# Altium project AudioBox_Amp.PrjPcb
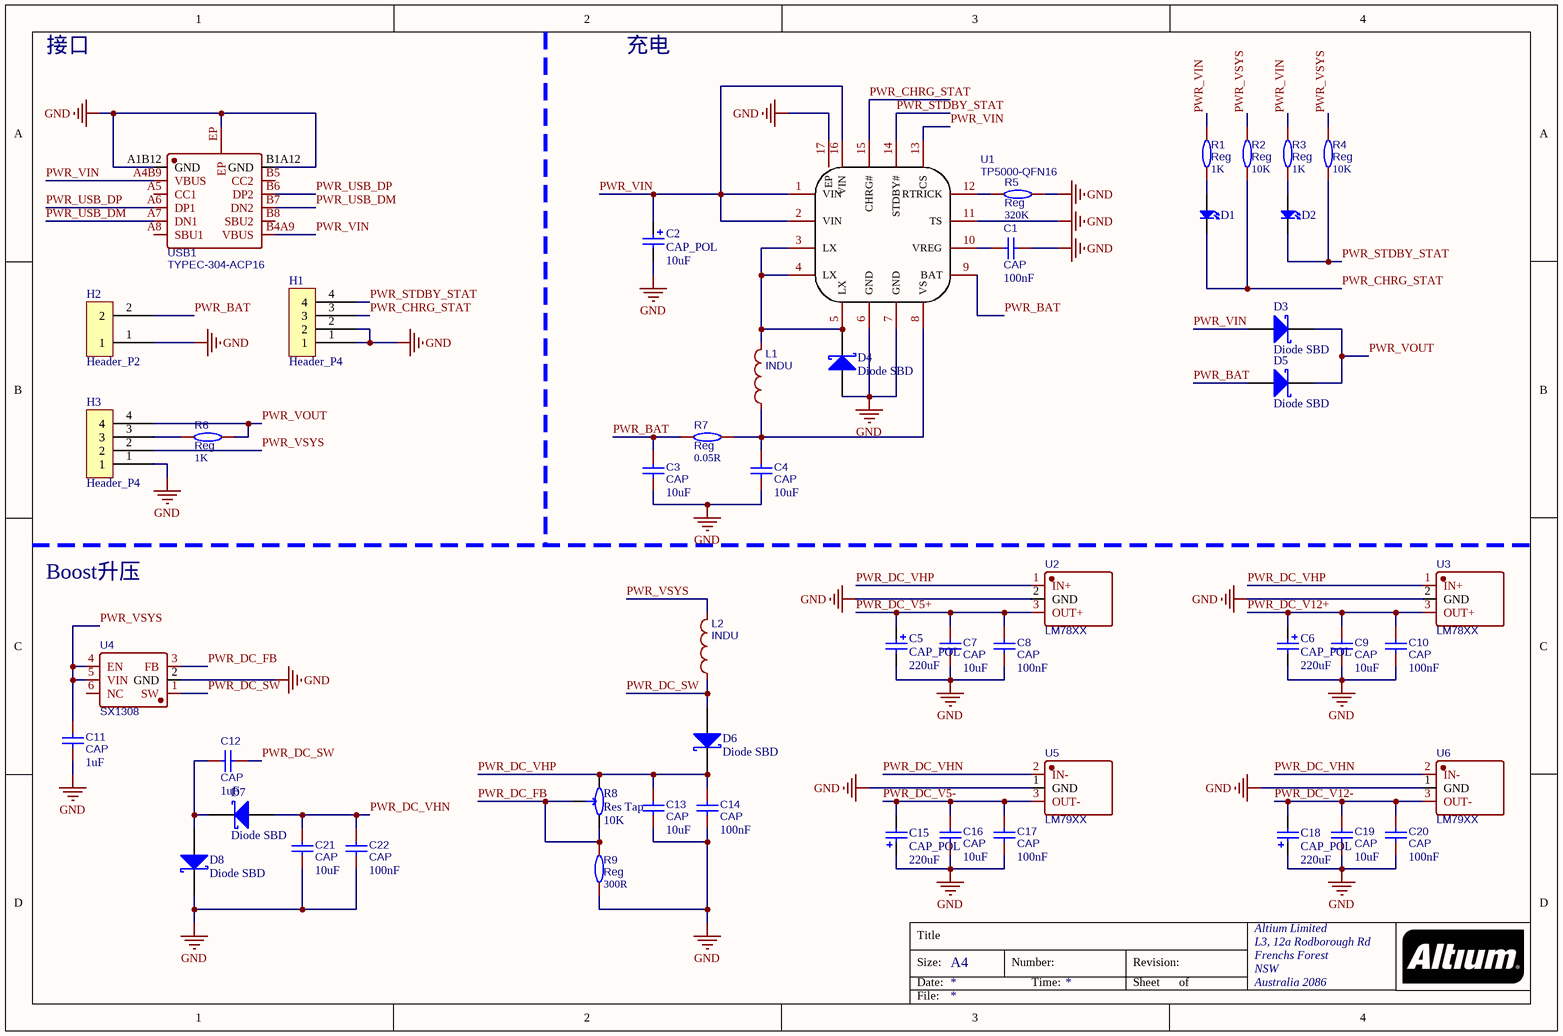
[diagram p0: Power.SchDoc]
4 sheets, 214 parts. Net scope: global (net labels, ports and power ports of the same name join across sheets).
Board files: AudioBoxAmpV3.PcbDoc, AudioBoxAmpV3-2.PcbDoc, AudioBoxAmpV3-3.PcbDoc
Sheets:
  Power.SchDoc
  Audio.SchDoc
  VU_LED.SchDoc
  FrantPannel.SchDoc

## Sheet Power.SchDoc
size A4; Organization: Altium Limited; Address1: L3, 12a Rodborough Rd; Address2: Frenchs Forest; Address3: NSW; Address4: Australia 2086

### Parts
C1  CAP  value 100nF  [C0603]
C2  CAP_POL  value 10uF  [CP1206]
C3  CAP  value 10uF  [C0603]
C4  CAP  value 10uF  [C0603]
C5  CAP_POL  value 220uF  [CAP_SMD_6.3mm]
C6  CAP_POL  value 220uF  [CAP_SMD_6.3mm]
C7  CAP  value 10uF  [C0603]
C8  CAP  value 100nF  [C0603]
C9  CAP  value 10uF  [C0603]
C10  CAP  value 100nF  [C0603]
C11  CAP  value 1uF  [C0603]
C12  CAP  value 1uF  [C0603]
C13  CAP  value 10uF  [C0603]
C14  CAP  value 100nF  [C0603]
C15  CAP_POL  value 220uF  [CAP_SMD_6.3mm]
C16  CAP  value 10uF  [C0603]
C17  CAP  value 100nF  [C0603]
C18  CAP_POL  value 220uF  [CAP_SMD_6.3mm]
C19  CAP  value 10uF  [C0603]
C20  CAP  value 100nF  [C0603]
C21  CAP  value 10uF  [C0603]
C22  CAP  value 100nF  [C0603]
D1  LED  [LED0603_Side]  (value not drawn)
D2  LED  [LED0603_Side]  (value not drawn)
D3  Diode SBD  [SMA_L4.3]
D4  Diode SBD  [SMA_L4.3]
D5  Diode SBD  [SMA_L4.3]
D6  Diode SBD  [SMA_L4.3]
D7  Diode SBD  [SMA_L4.3]
D8  Diode SBD  [SMA_L4.3]
H1  Header_P4  [PH_4Pin]
H2  Header_P2  [XH_2Pin]
H3  Header_P4  [PH_4Pin]
L1  INDU  [SMD_L7.1]
L2  INDU  [SMD_L7.1]
R1  Reg  value 1K  [R0603]
R2  Reg  value 10K  [R0603]
R3  Reg  value 1K  [R0603]
R4  Reg  value 10K  [R0603]
R5  Reg  value 320K  [R0603]
R6  Reg  value 1K  [R0603]
R7  Reg  value 0.05R  [R2512]
R8  Res Tap  value 10K  [RES_TAP_HOR]
R9  Reg  value 300R  [R0603]
U1  TP5000-QFN16  [QFN-16_L4.0-W4.0-P0.65-BL-EP2.2]
U2  LM78XX  [TO-220-3_2.54_HOR]
U3  LM78XX  [TO-220-3_2.54_HOR]
U4  SX1308  [SOT-23-6]
U5  LM79XX  [TO-220-3_2.54_HOR]
U6  LM79XX  [TO-220-3_2.54_HOR]
USB1  TYPEC-304-ACP16  [USB-C-SMD_TYPE-C-16P]

### Nets
GND: C1.2 C2.2 C3.2 C4.2 C5.2 C6.2 C7.2 C8.2 C9.2 C10.2 C11.2 C13.2 C14.2 C15.1 C16.2 C17.2 C18.1 C19.2 C20.2 C21.2 C22.2 D4.2(A) D8.1(K) H1.1 H1.2 H2.1 H3.1 R5.2 R9.1 U1.6(GND) U1.7(GND) U1.11(TS) U1.17(EP) U2.2(GND) U3.2(GND) U4.2(GND) U5.1(GND) U6.1(GND) USB1.A1B12(GND) USB1.B1A12(GND) USB1.EP
PWR_BAT: C3.1 D5.2(A) H2.2 R7.1 U1.9(BAT)
PWR_CHRG_STAT: D1.1(K) H1.3 R2.1 U1.15(CHRG#)
PWR_DC_FB: R8.1(A) R8.3(TAP) R9.2 U4.3(FB)
PWR_DC_SW: C12.1 D6.2(A) L2.1 U4.1(SW)
PWR_DC_V5+: C5.1 C7.1 C8.1 U2.3(OUT+)
PWR_DC_V5-: C15.2 C16.1 C17.1 U5.3(OUT-)
PWR_DC_V12+: C6.1 C9.1 C10.1 U3.3(OUT+)  [project net A_VLB12V+]
PWR_DC_V12-: C18.2 C19.1 C20.1 U6.3(OUT-)  [project net A_VLB12V-]
PWR_DC_VHN: C21.1 C22.1 D7.2(A) U5.2(IN-) U6.2(IN-)
PWR_DC_VHP: C13.1 C14.1 D6.1(K) R8.2(B) U2.1(IN+) U3.1(IN+)
PWR_STDBY_STAT: D2.1(K) H1.4 R4.1 U1.14(STDBY#)
PWR_USB_DM: USB1.A7(DN1) USB1.B7(DN2)
PWR_USB_DP: USB1.A6(DP1) USB1.B6(DP2)
PWR_VIN: C2.1 D3.2(A) R1.2 R3.2 U1.1(VIN) U1.2(VIN) U1.13(CS) U1.16(VIN) USB1.A4B9(VBUS) USB1.B4A9(VBUS)
PWR_VOUT: D3.1(K) D5.1(K) H3.4 R6.1
PWR_VSYS: C11.1 H3.2 L2.2 R2.2 R4.2 U4.4(EN) U4.5(VIN)
NetC1_1: C1.1 U1.10(VREG)
NetC4_1: C4.1 L1.1 R7.2 U1.8(VS)
NetC12_2: C12.2 D7.1(K) D8.2(A)
NetD1_2: D1.2(A) R1.1
NetD2_2: D2.2(A) R3.1
NetD4_1: D4.1(K) L1.2 U1.3(LX) U1.4(LX) U1.5(LX)
NetH3_3: H3.3 R6.2
NetR5_1: R5.1 U1.12(RTRICK)

Not connected (* = marked no-connect by the designer): U4 6(NC); USB1 A5(CC1) A8(SBU1) B5(CC2) B8(SBU2)

### Notes on the sheet
- 接口
- 充电
- Boost升压
- Title
- Size:
- Date:
- A4
- Number:
- Time:
- Revision:
- Sheet
- of
- File:

### Library data of the parts
C1 C3 C4 C7-C14 C16 C17 C19-C22 = CAP: BOM_Manufacturer: Huaxin S&T; BOM_Manufacturer Part: 0603B103K101CT; nameAlias: Capacitance; Contributor: LCSC; BOM_Supplier: LCSC; BOM_Supplier Part: C302008; spicePre: C; spiceSymbolName: 0603B103K101CT
C2 C5 C6 C15 C18 = CAP_POL: 极性电容
D1 D2 = LED0: Published: 8-Jun-2000; LatestRevisionDate: 08-Jul-2005; LatestRevisionNote: Mech Layer 1 removed.; PackageReference: LED-0; Publisher: Altium Limited; PackageDescription: LED; 2 Leads
D3-D8 = Diode SBD: Schottky Rectifier; Note: Terminal 2 is the TAB and is electrically connected to the cathode; Published: 8-Jun-2000; LatestRevisionDate: 17-Jul-2002; LatestRevisionNote: Re-released for DXP Platform.; DatasheetVersion: PD-2.057B; PackageVersion: Feb-1998; PackageReference: TO-220AC; Publisher: Altium Limited; PackageDescription: TO, Thru-Hole, Vertical, Heatsink Mounted; 3 In-Line Leads (1 Absent); Pitch 2.54 mm; ComponentLink1Description: Manufacturer Link; ComponentLink1URL: http://www.irf.com/; ComponentLink2Description: Datasheet; ComponentLink2URL: http://www.irf.com/product-info/datasheets/data/10tq.pdf
H1 H3 = Header_P4: 4Pin排针
H2 = Header_P2: 2Pin排针
L1 L2 = IND: 电感; BOM_Manufacturer: Sunltech Tech; BOM_Manufacturer Part: SLO0630H150MTT; nameAlias: Inductance; Contributor: LCSC; BOM_Supplier: LCSC; BOM_Supplier Part: C182182; BOM_JLCPCB Part Class: Extended Part; spicePre: L; spiceSymbolName: SLO0630H150MTT; Value: *
R1-R7 R9 = Res: 电阻; BOM_Manufacturer: Viking Tech; BOM_Manufacturer Part: AR03BTCX1002A; nameAlias: Resistance (Ohms); Contributor: LCSC; BOM_Supplier: LCSC; BOM_Supplier Part: C465721; spicePre: R; spiceSymbolName: AR03BTCX1002A
R8 = Res Tap: 可调电阻; Sim Note: Enter the Resistance value and the set point into parameter fields.; Set Position: 0.5; Published: 24-Mar-1999; LatestRevisionDate: 17-Jul-2002; LatestRevisionNote: Re-released for DXP Platform.; PackageReference: VR3; Publisher: Altium Limited; PackageDescription: Variable Resistor, Thru-Hole; 3 Leads
U1 = TP5000-QFN16: BOM_Manufacturer: TOPPOWER; BOM_Supplier: LCSC; BOM_Manufacturer Part: TP5000-QFN16; BOM_Supplier Part: C51699; BOM_JLCPCB Part Class: Extended Part; spicePre: U; spiceSymbolName: TP5000-QFN16
U2 U3 = LM78XX: 三端稳压(正电压); BOM_Manufacturer: HGSEMI(华冠); BOM_Manufacturer Part: LM7812T; Contributor: LCSC; BOM_Supplier: LCSC; BOM_Supplier Part: C2902509; BOM_JLCPCB Part Class: Extended Part; spicePre: U; spiceSymbolName: LM7812T
U4 = SX1308: 升压PWM; BOM_Manufacturer: SX; sourceId: g4Yg9rJ1j; timeStamp: 1472247539; BOM_Supplier: LCSC; BOM_Manufacturer Part: SX1308; BOM_Supplier Part: C78162; BOM_JLCPCB Part Class: Extended Part; spicePre: U; spiceSymbolName: SX1308
U5 U6 = LM79XX: 三端稳压(负电压); BOM_Manufacturer: HGSEMI(华冠); BOM_Manufacturer Part: LM7812T; Contributor: LCSC; BOM_Supplier: LCSC; BOM_Supplier Part: C2902509; BOM_JLCPCB Part Class: Extended Part; spicePre: U; spiceSymbolName: LM7812T
USB1 = USB_TYPEC_12P: 全引脚USB TYPEC母座; BOM_Manufacturer: XUNPU(讯普); Contributor: LCSC; BOM_Supplier: LCSC; BOM_Supplier Part: C2982555; BOM_Manufacturer Part: TYPEC-304-ACP16; BOM_JLCPCB Part Class: Extended Part; spicePre: U; spiceSymbolName: TYPEC-304-ACP16

## Sheet Audio.SchDoc
size A4; Organization: Altium Limited; Address1: L3, 12a Rodborough Rd; Address2: Frenchs Forest; Address3: NSW; Address4: Australia 2086
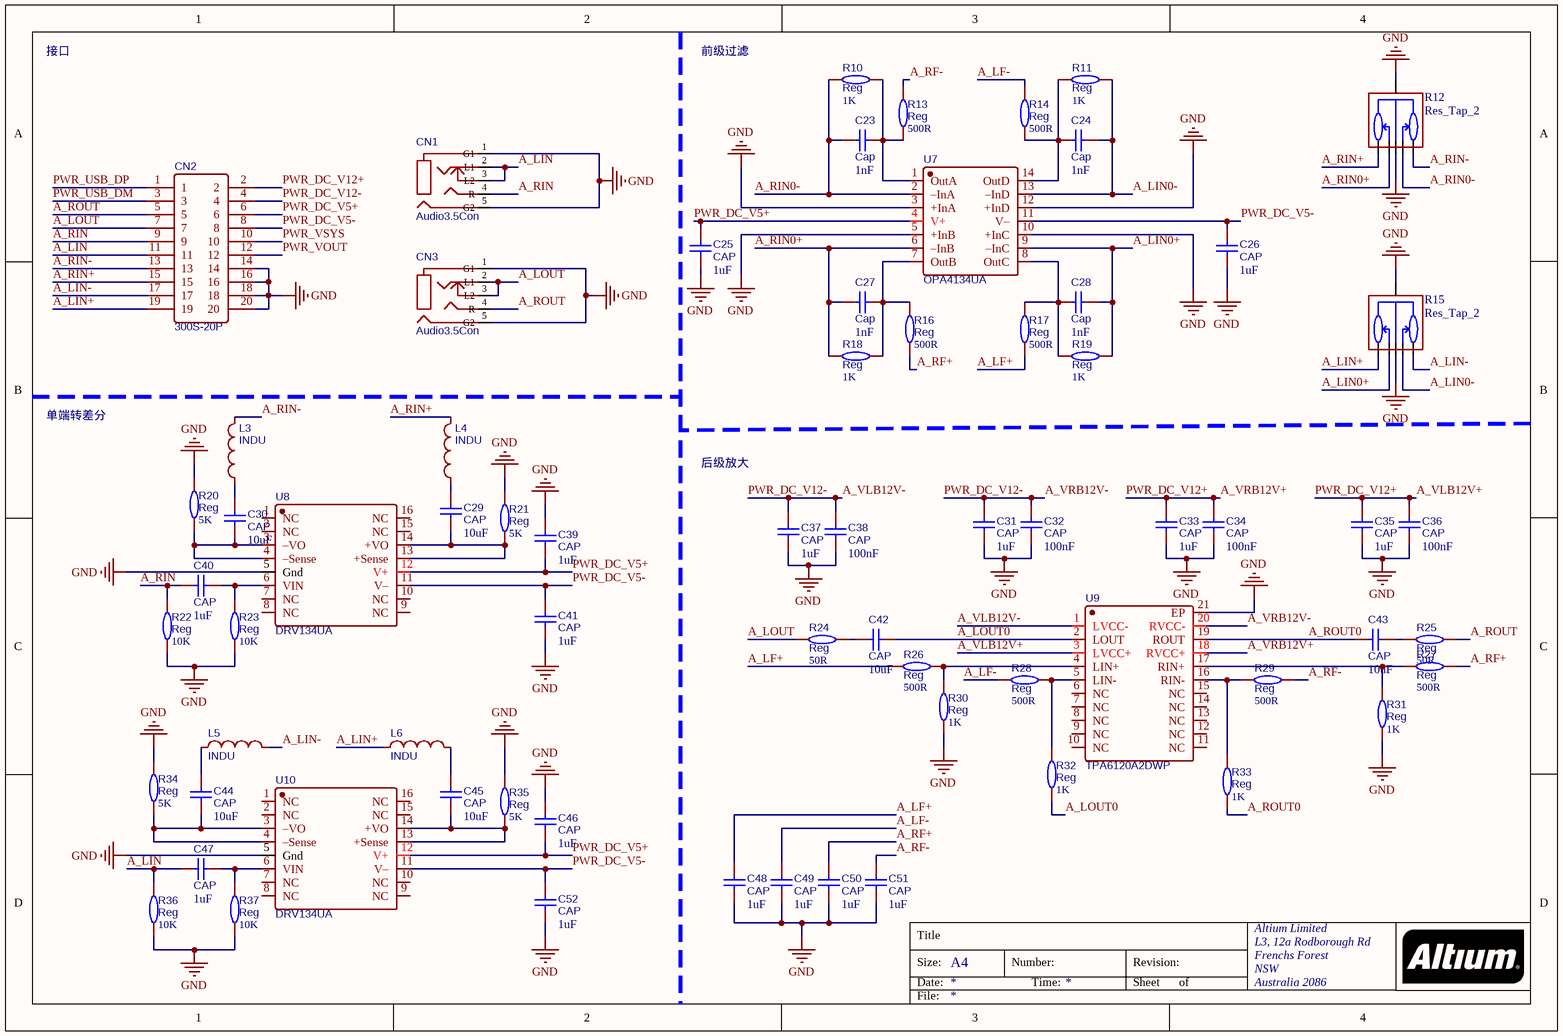
[diagram p1: Audio.SchDoc]

### Parts
C23  Cap  value 1nF  [C0603]
C24  Cap  value 1nF  [C0603]
C25  CAP  value 1uF  [C0603]
C26  CAP  value 1uF  [C0603]
C27  Cap  value 1nF  [C0603]
C28  Cap  value 1nF  [C0603]
C29  CAP  value 10uF  [C0603]
C30  CAP  value 10uF  [C0603]
C31  CAP  value 1uF  [C0603]
C32  CAP  value 100nF  [C0603]
C33  CAP  value 1uF  [C0603]
C34  CAP  value 100nF  [C0603]
C35  CAP  value 1uF  [C0603]
C36  CAP  value 100nF  [C0603]
C37  CAP  value 1uF  [C0603]
C38  CAP  value 100nF  [C0603]
C39  CAP  value 1uF  [C0603]
C40  CAP  value 1uF  [C0603]
C41  CAP  value 1uF  [C0603]
C42  CAP  value 10uF  [C0603]
C43  CAP  value 10uF  [C0603]
C44  CAP  value 10uF  [C0603]
C45  CAP  value 10uF  [C0603]
C46  CAP  value 1uF  [C0603]
C47  CAP  value 1uF  [C0603]
C48  CAP  value 1uF  [C0603]
C49  CAP  value 1uF  [C0603]
C50  CAP  value 1uF  [C0603]
C51  CAP  value 1uF  [C0603]
C52  CAP  value 1uF  [C0603]
CN1  Audio3.5Con  [Audio3.5_3Pin]
CN2  300S-20P  [DC_20P_2.54]
CN3  Audio3.5Con  [Audio3.5_3Pin]
L3  INDU  [L1210]
L4  INDU  [L1210]
L5  INDU  [L1210]
L6  INDU  [L1210]
R10  Reg  value 1K  [R0603]
R11  Reg  value 1K  [R0603]
R12  Res_Tap_2  [RES_TAP_5Pin]
R13  Reg  value 500R  [R0603]
R14  Reg  value 500R  [R0603]
R15  Res_Tap_2  [RES_TAP_5Pin]
R16  Reg  value 500R  [R0603]
R17  Reg  value 500R  [R0603]
R18  Reg  value 1K  [R0603]
R19  Reg  value 1K  [R0603]
R20  Reg  value 5K  [R0603]
R21  Reg  value 5K  [R0603]
R22  Reg  value 10K  [R0603]
R23  Reg  value 10K  [R0603]
R24  Reg  value 50R  [R0603]
R25  Reg  value 50R  [R0603]
R26  Reg  value 500R  [R0603]
R27  Reg  value 500R  [R0603]
R28  Reg  value 500R  [R0603]
R29  Reg  value 500R  [R0603]
R30  Reg  value 1K  [R0603]
R31  Reg  value 1K  [R0603]
R32  Reg  value 1K  [R0603]
R33  Reg  value 1K  [R0603]
R34  Reg  value 5K  [R0603]
R35  Reg  value 5K  [R0603]
R36  Reg  value 10K  [R0603]
R37  Reg  value 10K  [R0603]
U7  OPA4134UA  [SOIC-14]
U8  DRV134UA  [SOIC-16_9.5mm]
U9  TPA6120A2DWP  [HSOP-20]
U10  DRV134UA  [SOIC-16_9.5mm]

### Nets
GND: C25.1 C26.1 C31.1 C32.1 C33.1 C34.1 C35.1 C36.1 C37.1 C38.1 C39.2 C41.1 C46.2 C48.2 C49.2 C50.2 C51.2 C52.1 CN1.1(G1) CN1.5(G2) CN2.14 CN2.16 CN2.18 CN2.20 CN3.1(G1) CN3.5(G2) R12.1(G) R12.6(PAD) R15.1(G) R15.6(PAD) R20.2 R21.1 R22.1 R23.1 R30.1 R31.1 R34.2 R35.1 R36.1 R37.1 U7.3(+InA) U7.5(+InB) U7.10(+InC) U7.12(+InD) U8.5(Gnd) U9.21(EP) U10.5(Gnd)
A_LF+: C48.1 R17.1 R26.1
A_LF-: C49.1 R14.2 R28.1
A_LIN: C47.1 CN1.2(L1) CN1.3(L2) CN2.11 R36.2
A_LIN0+: C28.2 R15.3(CH2A) R19.2 U7.9(–InC)
A_LIN0-: C24.2 R11.2 R15.2(CH1A) U7.13(–InD)
A_LIN+: CN2.19 L6.1 R15.4(CH2B)
A_LIN-: CN2.17 L5.2 R15.5(CH1B)
A_LOUT: CN2.7 CN3.2(L1) CN3.3(L2) R24.1
A_LOUT0: C42.1 R32.1 U9.2(LOUT)
A_RF+: C50.1 R16.1 R27.1
A_RF-: C51.1 R13.2 R29.1
A_RIN: C40.1 CN1.4(R) CN2.9 R22.2
A_RIN0+: C27.1 R12.3(CH2A) R18.1 U7.6(–InB)
A_RIN0-: C23.1 R10.1 R12.2(CH1A) U7.2(–InA)
A_RIN+: CN2.15 L4.2 R12.4(CH2B)
A_RIN-: CN2.13 L3.2 R12.5(CH1B)
A_ROUT: CN2.5 CN3.4(R) R25.2
A_ROUT0: C43.2 R33.1 U9.19(ROUT)
A_VLB12V+: C33.2 C34.2 C35.2 C36.2 CN2.2 U9.3(LVCC+) U9.18(RVCC+)  [also labelled A_VRB12V+, PWR_DC_V12+]
A_VLB12V-: C31.2 C32.2 C37.2 C38.2 CN2.4 U9.1(LVCC-) U9.20(RVCC-)  [also labelled A_VRB12V-, PWR_DC_V12-]
PWR_DC_V5+: C25.2 C39.1 C46.1 CN2.6 U7.4(V+) U8.12(V+) U10.12(V+)
PWR_DC_V5-: C26.2 C41.2 C52.2 CN2.8 U7.11(V–) U8.11(V–) U10.11(V–)
PWR_USB_DM: CN2.3
PWR_USB_DP: CN2.1
PWR_VOUT: CN2.12
PWR_VSYS: CN2.10
NetC23_2: C23.2 R10.2 R13.1 U7.1(OutA)
NetC24_1: C24.1 R11.1 R14.1 U7.14(OutD)
NetC27_2: C27.2 R16.2 R18.2 U7.7(OutB)
NetC28_1: C28.1 R17.2 R19.1 U7.8(OutC)
NetC29_1: C29.1 R21.2 U8.13(+Sense) U8.14(+VO)
NetC29_2: C29.2 L4.1
NetC30_1: C30.1 R20.1 U8.3(–VO) U8.4(–Sense)
NetC30_2: C30.2 L3.1
NetC40_2: C40.2 R23.2 U8.6(VIN)
NetC42_2: C42.2 R24.2
NetC43_1: C43.1 R25.1
NetC44_1: C44.1 R34.1 U10.3(–VO) U10.4(–Sense)
NetC44_2: C44.2 L5.1
NetC45_1: C45.1 R35.2 U10.13(+Sense) U10.14(+VO)
NetC45_2: C45.2 L6.2
NetC47_2: C47.2 R37.2 U10.6(VIN)
NetR26_2: R26.2 R30.2 U9.4(LIN+)
NetR27_2: R27.2 R31.2 U9.17(RIN+)
NetR28_2: R28.2 R32.2 U9.5(LIN-)
NetR29_2: R29.2 R33.2 U9.16(RIN-)

Not connected (* = marked no-connect by the designer): U8 1(NC) 2(NC) 7(NC) 8(NC) 9(NC) 10(NC) 15(NC) 16(NC); U9 6(NC) 7(NC) 8(NC) 9(NC) 10(NC) 11(NC) 12(NC) 13(NC) 14(NC) 15(NC); U10 1(NC) 2(NC) 7(NC) 8(NC) 9(NC) 10(NC) 15(NC) 16(NC)

### Notes on the sheet
- 接口
- 前级过滤
- 单端转差分
- 后级放大
- Title
- Size:
- Date:
- A4
- Number:
- Time:
- Revision:
- Sheet
- of
- File:

### Library data of the parts
C23-C52 = CAP: as C1 on sheet Power; BOM_Supplier: LCSC; BOM_Supplier Part: C302008; spicePre: C; spiceSymbolName: 0603B103K101CT
CN1 CN3 = AudioCon3: 3.5mm 3Pin 音频接口; BOM_Manufacturer: G-Switch(品赞); BOM_Manufacturer Part: PJ-393; Contributor: LCSC; BOM_Supplier: LCSC; BOM_Supplier Part: C2837065; BOM_JLCPCB Part Class: Extended Part; spicePre: C; spiceSymbolName: PJ-393_C2837065
CN2 = DC-20P: DC牛角座，20P; BOM_Manufacturer: Shenzhen Cankemeng; Contributor: LCSC; BOM_Supplier: LCSC; BOM_Supplier Part: C132442; BOM_Manufacturer Part: -; BOM_JLCPCB Part Class: Extended Part; spicePre: C; spiceSymbolName: 300S-20P
L3-L6 = IND: as L1 on sheet Power; BOM_Supplier: LCSC; BOM_Supplier Part: C182182; BOM_JLCPCB Part Class: Extended Part; spicePre: L; spiceSymbolName: SLO0630H150MTT; Value: *
R10 R11 R13 R14 R16-R37 = Res: as R1 on sheet Power; BOM_Supplier: LCSC; BOM_Supplier Part: C465721; spicePre: R; spiceSymbolName: AR03BTCX1002A
R12 R15 = Res_Tap_2: 双联电位器
U7 = OPA4134UA: 耳放; BOM_Manufacturer: TI(德州仪器); Contributor: LCSC; BOM_Supplier: LCSC; BOM_Supplier Part: C2832240; BOM_Manufacturer Part: OPA4134UA; BOM_JLCPCB Part Class: Extended Part; spicePre: U; spiceSymbolName: OPA4134UA
U8 U10 = DRV134UA: 音频差分放大器; BOM_Manufacturer: TI(德州仪器); Contributor: LCSC; BOM_Supplier: LCSC; BOM_Supplier Part: C1519988; BOM_Manufacturer Part: DRV134UA; BOM_JLCPCB Part Class: Extended Part; spicePre: U; spiceSymbolName: DRV134UA
U9 = TPA6120: 耳放; BOM_Manufacturer: TI(德州仪器); Contributor: LCSC; BOM_Supplier: LCSC; BOM_Supplier Part: C2871054; BOM_Manufacturer Part: TPA6120A2DWP; link: https://atta.szlcsc.comnull; spicePre: U; spiceSymbolName: TPA6120A2DWP

## Sheet VU_LED.SchDoc
size A4; Organization: Altium Limited; Address1: L3, 12a Rodborough Rd; Address2: Frenchs Forest; Address3: NSW; Address4: Australia 2086
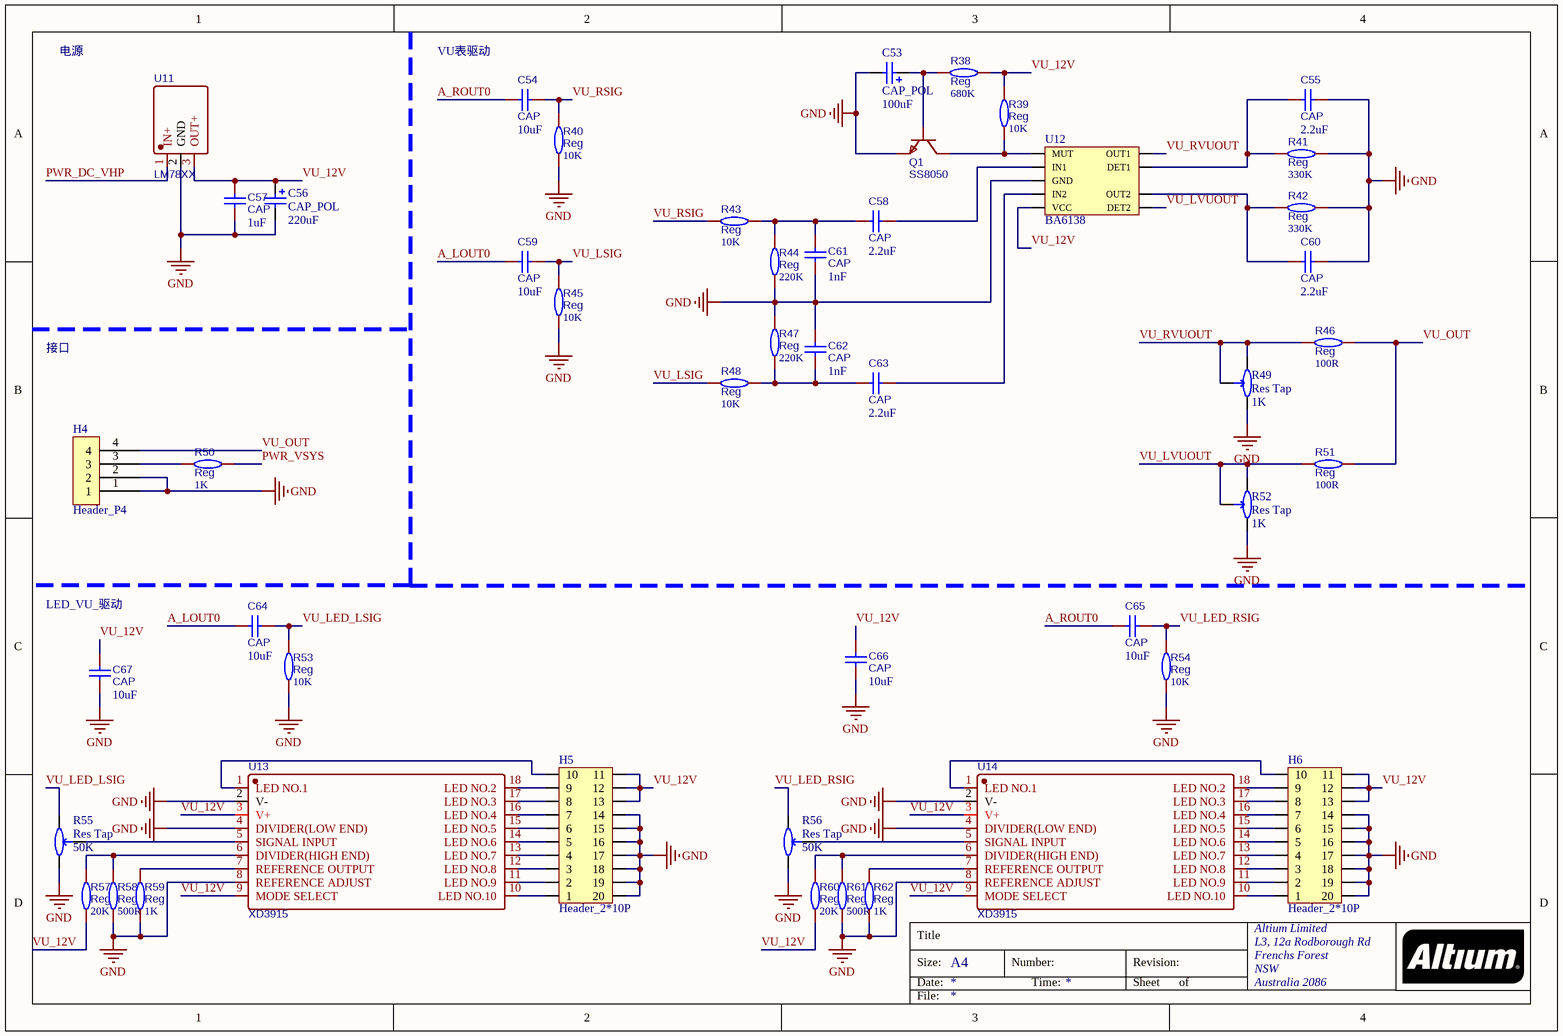
[diagram p2: VU_LED.SchDoc]

### Parts
C53  CAP_POL  value 100uF  [CAP_SMD_6.3mm]
C54  CAP  value 10uF  [C0603]
C55  CAP  value 2.2uF  [C0603]
C56  CAP_POL  value 220uF  [CAP_SMD_6.3mm]
C57  CAP  value 1uF  [C0603]
C58  CAP  value 2.2uF  [C0603]
C59  CAP  value 10uF  [C0603]
C60  CAP  value 2.2uF  [C0603]
C61  CAP  value 1nF  [C0603]
C62  CAP  value 1nF  [C0603]
C63  CAP  value 2.2uF  [C0603]
C64  CAP  value 10uF  [C0603]
C65  CAP  value 10uF  [C0603]
C66  CAP  value 10uF  [C0603]
C67  CAP  value 10uF  [C0603]
H4  Header_P4  [PH_4Pin]
H5  Header_2*10P  [H_2.0_10x2Pin]
H6  Header_2*10P  [H_2.0_10x2Pin]
Q1  SS8050  [SOT-23-3]
R38  Reg  value 680K  [R0603]
R39  Reg  value 10K  [R0603]
R40  Reg  value 10K  [R0603]
R41  Reg  value 330K  [R0603]
R42  Reg  value 330K  [R0603]
R43  Reg  value 10K  [R0603]
R44  Reg  value 220K  [R0603]
R45  Reg  value 10K  [R0603]
R46  Reg  value 100R  [R0603]
R47  Reg  value 220K  [R0603]
R48  Reg  value 10K  [R0603]
R49  Res Tap  value 1K  [RES_TAP_HOR]
R50  Reg  value 1K  [R0603]
R51  Reg  value 100R  [R0603]
R52  Res Tap  value 1K  [RES_TAP_HOR]
R53  Reg  value 10K  [R0603]
R54  Reg  value 10K  [R0603]
R55  Res Tap  value 50K  [RES_TAP_HOR]
R56  Res Tap  value 50K  [RES_TAP_HOR]
R57  Reg  value 20K  [R0603]
R58  Reg  value 500R  [R0603]
R59  Reg  value 1K  [R0603]
R60  Reg  value 20K  [R0603]
R61  Reg  value 500R  [R0603]
R62  Reg  value 1K  [R0603]
U11  LM78XX  [TO-220-3_2.54_HOR]
U12  BA6138  [SIP9-2.54]
U13  XD3915  [DIP-18]
U14  XD3915  [DIP-18]

### Nets
GND: C53.2 C55.1 C56.2 C57.2 C60.1 C61.1 C62.2 C66.2 C67.2 H4.1 H4.2 H5.14 H5.15 H5.16 H5.17 H5.18 H5.19 H5.20 H6.14 H6.15 H6.16 H6.17 H6.18 H6.19 H6.20 Q1.2(E) R40.1 R41.1 R42.1 R44.2 R45.1 R47.1 R49.1(A) R52.1(A) R53.1 R54.1 R55.2(B) R56.2(B) R58.2 R59.2 R61.2 R62.2 U11.2(GND) U12.5(GND) U13.2(V-) U13.4(DIVIDER(LOW_END)) U13.8(REFERENCE_ADJUST) U14.2(V-) U14.4(DIVIDER(LOW_END)) U14.8(REFERENCE_ADJUST)
A_LOUT0: C59.1 C64.1
A_ROUT0: C54.1 C65.1
PWR_DC_VHP: U11.1(IN+)
PWR_VSYS: R50.1
VU_12V: C56.1 C57.1 C66.1 C67.1 H5.11 H5.12 H5.13 H6.11 H6.12 H6.13 R38.1 R39.2 R57.2 R60.2 U11.3(OUT+) U12.9(VCC) U13.3(V+) U13.9(MODE_SELECT) U14.3(V+) U14.9(MODE_SELECT)
VU_LED_LSIG: C64.2 R53.2 R55.1(A)
VU_LED_RSIG: C65.2 R54.2 R56.1(A)
VU_LSIG: C59.2 R45.2 R48.2
VU_LVUOUT: R51.2 R52.2(B) R52.3(TAP) U12.7(DET2)
VU_OUT: H4.4 R46.1 R51.1
VU_RSIG: C54.2 R40.2 R43.2
VU_RVUOUT: R46.2 R49.2(B) R49.3(TAP) U12.2(OUT1)
NetC53_1: C53.1 Q1.1(B) R38.2
NetC55_2: C55.2 R41.2 U12.3(DET1)
NetC58_1: C58.1 C61.2 R43.1 R44.1
NetC58_2: C58.2 U12.4(IN1)
NetC60_2: C60.2 R42.2 U12.8(OUT2)
NetC62_1: C62.1 C63.1 R47.2 R48.1
NetC63_2: C63.2 U12.6(IN2)
NetH4_3: H4.3 R50.2
NetH5_1: H5.1 U13.10(LED_NO.10)
NetH5_2: H5.2 U13.11(LED_NO.9)
NetH5_3: H5.3 U13.12(LED_NO.8)
NetH5_4: H5.4 U13.13(LED_NO.7)
NetH5_5: H5.5 U13.14(LED_NO.6)
NetH5_6: H5.6 U13.15(LED_NO.5)
NetH5_7: H5.7 U13.16(LED_NO.4)
NetH5_8: H5.8 U13.17(LED_NO.3)
NetH5_9: H5.9 U13.18(LED_NO.2)
NetH5_10: H5.10 U13.1(LED_NO.1)
NetH6_1: H6.1 U14.10(LED_NO.10)
NetH6_2: H6.2 U14.11(LED_NO.9)
NetH6_3: H6.3 U14.12(LED_NO.8)
NetH6_4: H6.4 U14.13(LED_NO.7)
NetH6_5: H6.5 U14.14(LED_NO.6)
NetH6_6: H6.6 U14.15(LED_NO.5)
NetH6_7: H6.7 U14.16(LED_NO.4)
NetH6_8: H6.8 U14.17(LED_NO.3)
NetH6_9: H6.9 U14.18(LED_NO.2)
NetH6_10: H6.10 U14.1(LED_NO.1)
NetQ1_3: Q1.3(C) R39.1 U12.1(MUT)
NetR55_3: R55.3(TAP) U13.5(SIGNAL_INPUT)
NetR56_3: R56.3(TAP) U14.5(SIGNAL_INPUT)
NetR57_1: R57.1 R58.1 U13.6(DIVIDER(HIGH_END))
NetR59_1: R59.1 U13.7(REFERENCE_OUTPUT)
NetR60_1: R60.1 R61.1 U14.6(DIVIDER(HIGH_END))
NetR62_1: R62.1 U14.7(REFERENCE_OUTPUT)

### Notes on the sheet
- 电源
- VU表驱动
- 接口
- LED_VU_驱动
- Title
- Size:
- Date:
- A4
- Number:
- Time:
- Revision:
- Sheet
- of
- File:

### Library data of the parts
C53 C56 = CAP_POL: 极性电容
C54 C55 C57-C67 = CAP: as C1 on sheet Power; BOM_Supplier: LCSC; BOM_Supplier Part: C302008; spicePre: C; spiceSymbolName: 0603B103K101CT
H4 = Header_P4: 4Pin排针
H5 H6 = Header_2*10P: 2*10P连接器
Q1 = SS8050: NPN; BOM_Manufacturer: AnBon; Contributor: LCSC; BOM_Paste Type: recommend; BOM_Supplier: LCSC; BOM_Supplier Part: C541705; BOM_Manufacturer Part: SS8050; spicePre: Q; spiceSymbolName: SS8050_C541705
R38-R48 R50 R51 R53 R54 R57-R62 = Res: as R1 on sheet Power; BOM_Supplier: LCSC; BOM_Supplier Part: C465721; spicePre: R; spiceSymbolName: AR03BTCX1002A
R49 R52 R55 R56 = Res Tap: as R8 on sheet Power; Published: 24-Mar-1999; LatestRevisionDate: 17-Jul-2002; LatestRevisionNote: Re-released for DXP Platform.; PackageReference: VR3; Publisher: Altium Limited; PackageDescription: Variable Resistor, Thru-Hole; 3 Leads
U11 = LM78XX: as U2 on sheet Power; BOM_Supplier: LCSC; BOM_Supplier Part: C2902509; BOM_JLCPCB Part Class: Extended Part; spicePre: U; spiceSymbolName: LM7812T
U12 = BA6138: 对数放大器
U13 U14 = LM3915: 电平指示; BOM_Manufacturer: XINLUDA(信路达); Contributor: LCSC; BOM_Supplier: LCSC; BOM_Supplier Part: C609778; BOM_Manufacturer Part: XD3915; BOM_JLCPCB Part Class: Extended Part; Frequency: -; spicePre: U; spiceSymbolName: XD3915

## Sheet FrantPannel.SchDoc
size A4; Organization: Altium Limited; Address1: L3, 12a Rodborough Rd; Address2: Frenchs Forest; Address3: NSW; Address4: Australia 2086
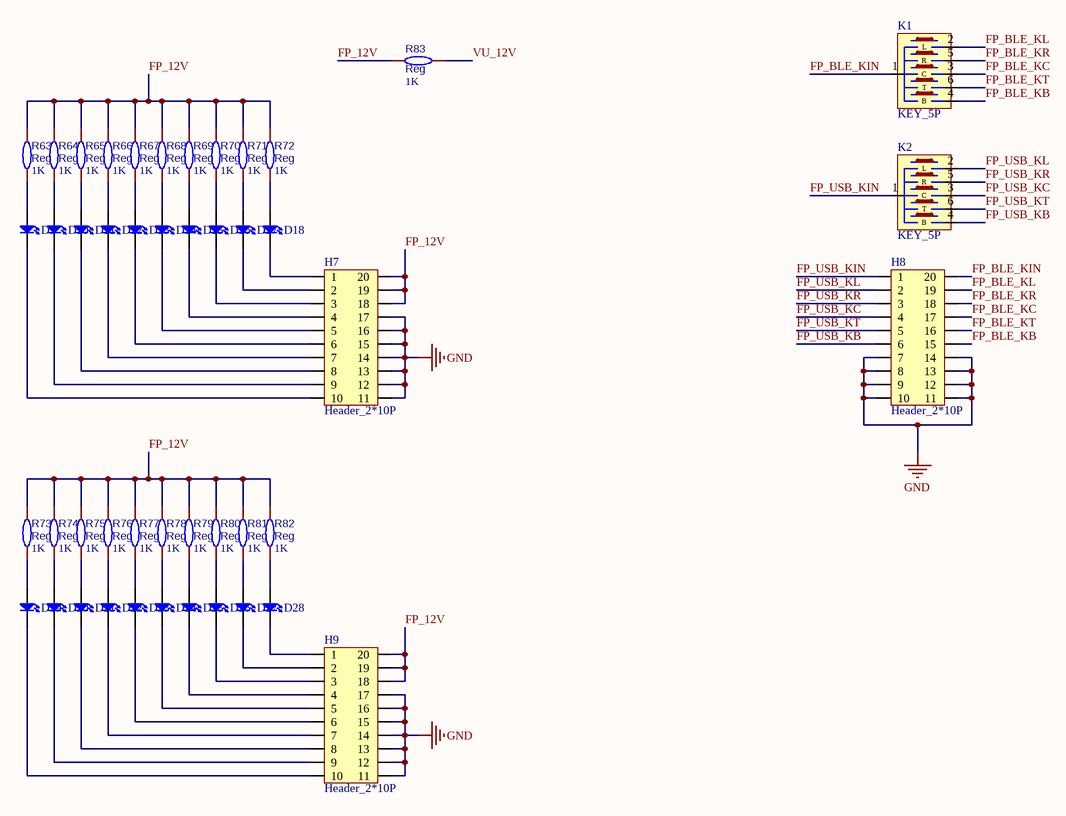
[diagram p3: FrantPannel.SchDoc]

### Parts
D9  LED  [LED0603]  (value not drawn)
D10  LED  [LED0603]  (value not drawn)
D11  LED  [LED0603]  (value not drawn)
D12  LED  [LED0603]  (value not drawn)
D13  LED  [LED0603]  (value not drawn)
D14  LED  [LED0603]  (value not drawn)
D15  LED  [LED0603]  (value not drawn)
D16  LED  [LED0603]  (value not drawn)
D17  LED  [LED0603]  (value not drawn)
D18  LED  [LED0603]  (value not drawn)
D19  LED  [LED0603]  (value not drawn)
D20  LED  [LED0603]  (value not drawn)
D21  LED  [LED0603]  (value not drawn)
D22  LED  [LED0603]  (value not drawn)
D23  LED  [LED0603]  (value not drawn)
D24  LED  [LED0603]  (value not drawn)
D25  LED  [LED0603]  (value not drawn)
D26  LED  [LED0603]  (value not drawn)
D27  LED  [LED0603]  (value not drawn)
D28  LED  [LED0603]  (value not drawn)
H7  Header_2*10P  [H_2.0_2x10Pin_SMD]
H8  Header_2*10P  [H_2.0_2x10Pin_SMD]
H9  Header_2*10P  [H_2.0_2x10Pin_SMD]
K1  KEY_5P  [KEY_5]
K2  KEY_5P  [KEY_5]
R63  Reg  value 1K  [R0603]
R64  Reg  value 1K  [R0603]
R65  Reg  value 1K  [R0603]
R66  Reg  value 1K  [R0603]
R67  Reg  value 1K  [R0603]
R68  Reg  value 1K  [R0603]
R69  Reg  value 1K  [R0603]
R70  Reg  value 1K  [R0603]
R71  Reg  value 1K  [R0603]
R72  Reg  value 1K  [R0603]
R73  Reg  value 1K  [R0603]
R74  Reg  value 1K  [R0603]
R75  Reg  value 1K  [R0603]
R76  Reg  value 1K  [R0603]
R77  Reg  value 1K  [R0603]
R78  Reg  value 1K  [R0603]
R79  Reg  value 1K  [R0603]
R80  Reg  value 1K  [R0603]
R81  Reg  value 1K  [R0603]
R82  Reg  value 1K  [R0603]
R83  Reg  value 1K  [R0603]

### Nets
GND: H7.11 H7.12 H7.13 H7.14 H7.15 H7.16 H7.17 H8.7 H8.8 H8.9 H8.10 H8.11 H8.12 H8.13 H8.14 H9.11 H9.12 H9.13 H9.14 H9.15 H9.16 H9.17
FP_12V: H7.18 H7.19 H7.20 H9.18 H9.19 H9.20 R63.2 R64.2 R65.2 R66.2 R67.2 R68.2 R69.2 R70.2 R71.2 R72.2 R73.2 R74.2 R75.2 R76.2 R77.2 R78.2 R79.2 R80.2 R81.2 R82.2 R83.2
FP_BLE_KB: H8.15 K1.4(B)
FP_BLE_KC: H8.17 K1.3(C)
FP_BLE_KIN: H8.20 K1.1(G)
FP_BLE_KL: H8.19 K1.2(L)
FP_BLE_KR: H8.18 K1.5(R)
FP_BLE_KT: H8.16 K1.6(T)
FP_USB_KB: H8.6 K2.4(B)
FP_USB_KC: H8.4 K2.3(C)
FP_USB_KIN: H8.1 K2.1(G)
FP_USB_KL: H8.2 K2.2(L)
FP_USB_KR: H8.3 K2.5(R)
FP_USB_KT: H8.5 K2.6(T)
VU_12V: R83.1
NetD9_1: D9.1(K) H7.10
NetD9_2: D9.2(A) R63.1
NetD10_1: D10.1(K) H7.9
NetD10_2: D10.2(A) R64.1
NetD11_1: D11.1(K) H7.8
NetD11_2: D11.2(A) R65.1
NetD12_1: D12.1(K) H7.7
NetD12_2: D12.2(A) R66.1
NetD13_1: D13.1(K) H7.6
NetD13_2: D13.2(A) R67.1
NetD14_1: D14.1(K) H7.5
NetD14_2: D14.2(A) R68.1
NetD15_1: D15.1(K) H7.4
NetD15_2: D15.2(A) R69.1
NetD16_1: D16.1(K) H7.3
NetD16_2: D16.2(A) R70.1
NetD17_1: D17.1(K) H7.2
NetD17_2: D17.2(A) R71.1
NetD18_1: D18.1(K) H7.1
NetD18_2: D18.2(A) R72.1
NetD19_1: D19.1(K) H9.10
NetD19_2: D19.2(A) R73.1
NetD20_1: D20.1(K) H9.9
NetD20_2: D20.2(A) R74.1
NetD21_1: D21.1(K) H9.8
NetD21_2: D21.2(A) R75.1
NetD22_1: D22.1(K) H9.7
NetD22_2: D22.2(A) R76.1
NetD23_1: D23.1(K) H9.6
NetD23_2: D23.2(A) R77.1
NetD24_1: D24.1(K) H9.5
NetD24_2: D24.2(A) R78.1
NetD25_1: D25.1(K) H9.4
NetD25_2: D25.2(A) R79.1
NetD26_1: D26.1(K) H9.3
NetD26_2: D26.2(A) R80.1
NetD27_1: D27.1(K) H9.2
NetD27_2: D27.2(A) R81.1
NetD28_1: D28.1(K) H9.1
NetD28_2: D28.2(A) R82.1

### Notes on the sheet
- Title
- Size:
- Date:
- A4
- Number:
- Time:
- Revision:
- Sheet
- of
- File:

### Library data of the parts
D9-D28 = LED0: Published: 8-Jun-2000; LatestRevisionDate: 08-Jul-2005; LatestRevisionNote: Mech Layer 1 removed.; PackageReference: LED-0; Publisher: Altium Limited; PackageDescription: LED; 2 Leads
H7-H9 = Header_2*10P: 2*10P连接器
K1 K2 = KEY_5P: 五向开关
R63-R83 = Res: as R1 on sheet Power; BOM_Supplier: LCSC; BOM_Supplier Part: C465721; spicePre: R; spiceSymbolName: AR03BTCX1002A

## Nets that join several sheets
GND: Power (41 pins), Audio (47 pins), VU_LED (50 pins), FrantPannel (22 pins)
A_LOUT0: Audio (C42.1 R32.1 U9.2), VU_LED (C59.1 C64.1)
A_ROUT0: Audio (C43.2 R33.1 U9.19), VU_LED (C54.1 C65.1)
A_VLB12V+: Power (C6.1 C9.1 C10.1 U3.3), Audio (7 pins)
A_VLB12V-: Power (C18.2 C19.1 C20.1 U6.3), Audio (7 pins)
PWR_DC_V5+: Power (C5.1 C7.1 C8.1 U2.3), Audio (7 pins)
PWR_DC_V5-: Power (C15.2 C16.1 C17.1 U5.3), Audio (7 pins)
PWR_DC_VHP: Power (6 pins), VU_LED (U11.1)
PWR_USB_DM: Power (USB1.A7 USB1.B7), Audio (CN2.3)
PWR_USB_DP: Power (USB1.A6 USB1.B6), Audio (CN2.1)
PWR_VOUT: Power (D3.1 D5.1 H3.4 R6.1), Audio (CN2.12)
PWR_VSYS: Power (7 pins), Audio (CN2.10), VU_LED (R50.1)
VU_12V: VU_LED (20 pins), FrantPannel (R83.1)